# Altium schematic sheet POWER.SchDoc
size A3; SheetNumber: 1; SheetTotal: 2
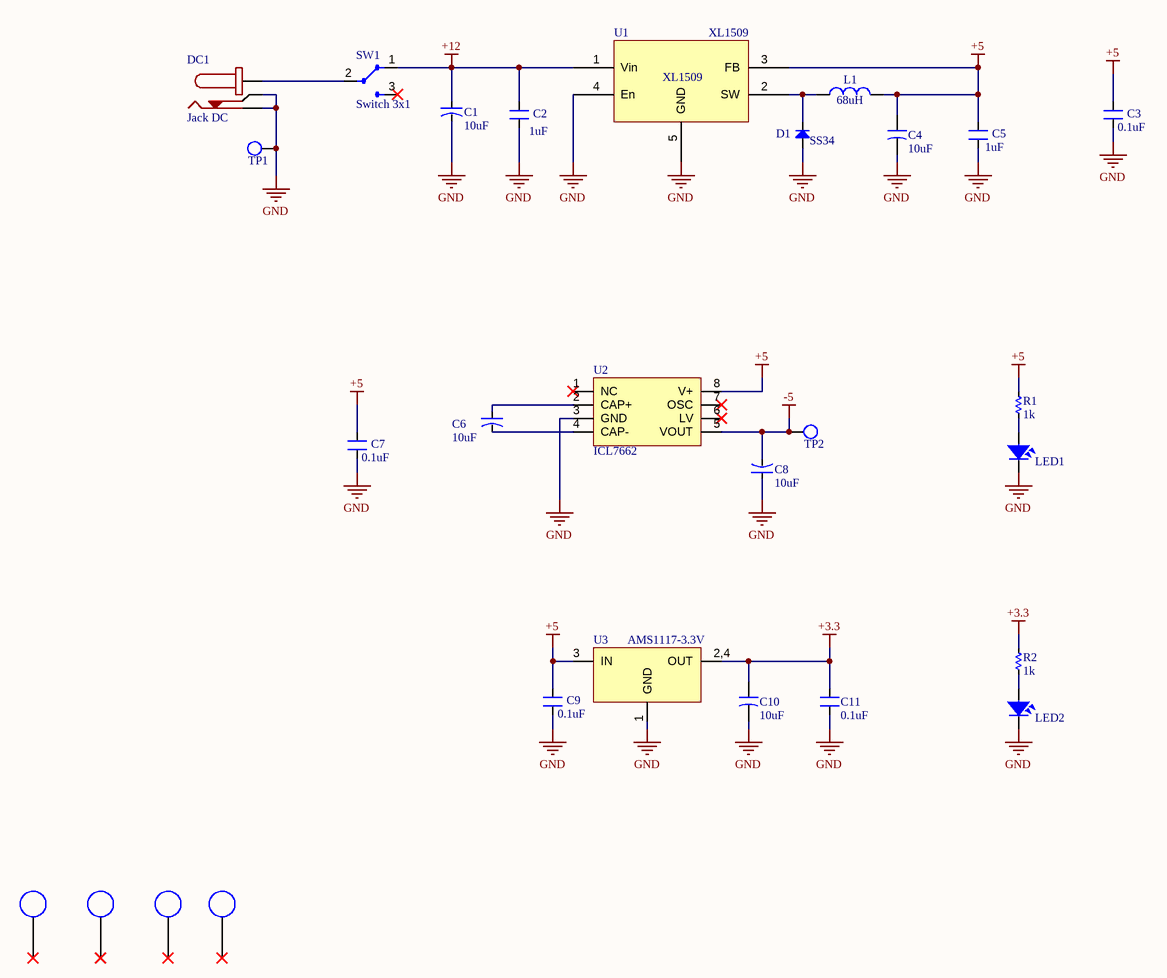
[diagram p0: POWER.SchDoc]

## Parts
C1  10uF  [CAP-ALU-SMD-4.5x5x1.4]
C2  1uF  [CN-SMD-0603]
C3  0.1uF  [CN-SMD-0603]
C4  10uF  [CAP-ALU-SMD-4.5x5x1.4]
C5  1uF  [CN-SMD-0603]
C6  10uF  [CAP-ALU-SMD-4.5x5x1.4]
C7  0.1uF  [CN-SMD-0603]
C8  10uF  [CAP-ALU-SMD-4.5x5x1.4]
C9  0.1uF  [CN-SMD-0603]
C10  10uF  [CAP-ALU-SMD-4.5x5x1.4]
C11  0.1uF  [CN-SMD-0603]
D1  SS34  [DIO-SMD-A]
DC1  Jack DC  [DC0]
H1  M3  [M3]  (value not drawn)
H2  M3  [M3]  (value not drawn)
H3  M3  [M3]  (value not drawn)
H4  M3  [M3]  (value not drawn)
L1  68uH  [L-SMD-M-12x8]
LED1  LED  [LED-0805-Red]  (value not drawn)
LED2  LED  [LED-0805-Red]  (value not drawn)
R1  1k  [RES-SMD-0603]
R2  1k  [RES-SMD-0603]
SW1  Switch 3x1  [SS12D10]
TP1  Test-Point  [TESTPOINT]  (value not drawn)
TP2  Test-Point  [TESTPOINT]  (value not drawn)
U1  XL1509  [SO8]
U2  ICL7662  [SO8]
U3  AMS1117-3.3V  [SOT223]

## Nets
+3.3: C10.1 C11.1 R2.2 U3.2,4(OUT)
+5: C3.1 C4.1 C5.1 C7.1 C9.1 L1.2 R1.2 U1.3(FB) U2.8(V+) U3.3(IN)
+12: C1.1 C2.1 SW1.1 U1.1(Vin)
-5: C8.2 TP2.1 U2.5(VOUT)
GND: C1.2 C2.2 C3.2 C4.2 C5.2 C7.2 C8.1 C9.2 C10.2 C11.2 D1.1(A) DC1.2(TN) DC1.3(T) LED1.2 LED2.2 TP1.1 U1.4(En) U1.5(GND) U2.3(GND) U3.1(GND)
NetC6_1: C6.1 U2.2(CAP+)
NetC6_2: C6.2 U2.4(CAP-)
NetD1_2: D1.2(K) L1.1 U1.2(SW)
NetDC1_1: DC1.1(S) SW1.2
NetLED1_1: LED1.1 R1.1
NetLED2_1: LED2.1 R2.1

Not connected (* = marked no-connect by the designer): H1 1(76)*; H2 1(76)*; H3 1(76)*; H4 1(76)*; SW1 3(I/O2)*; U2 1(NC)* 6(LV)* 7(OSC)*

## Notes on the sheet
- Project:
- Sheet title:
- BAO BUI Q.
- SAMY VE & VY TRAN
- A3
- Sheet
- Checked by:
- of
- Revision:
- Designed by:
- Size:
- Date:

## Library data of the parts
C1 C6 C8 = CN-ALU-DIP: Capacitor (Semiconductor SIM Model); Value: 104; LatestRevisionDate: 17-Jul-2002; LatestRevisionNote: Re-released for DXP Platform.; PackageReference: C1206; Publisher: Altium Limited
C2 C3 C5 C7 C9 C11 = CN: Value: 33pF
C4 C10 = CN-SMD: Polarized Capacitor (Axial); Published: 8-Jun-2000; LatestRevisionDate: 17-Jul-2002; LatestRevisionNote: Re-released for DXP Platform.; PackageReference: POLAR0.8; Publisher: Altium Limited
D1 = Diode SMD: Default Diode; Code - JEDEC: DO-214-AB; Value: 1N5007; Published: 8-Jun-2000; Revision: July-2002: Re-released for DXP Platform.; Publisher: Altium Limited
DC1 = DCIN: Jack DC input; Value: Jac DC
L1 = L-SMD-1: partNo: 78477010; Manufacturer: Wurth Elektronik; Inductance: 1.0 μH; ComponentLink1Description: Manufacturer; ComponentLink1URL: http://www.we-online.de; Created by: Baojun Chen; Created Date: Nov.2015; ComponentLink2Description: Datasheet; ComponentLink2URL: http://katalog.we-online.de/pbs/datasheet/78477010.pdf
LED1 LED2 = LED SMD: Value: LED 3 - 5 ly 2 Colour
R1 R2 = Res-SMD: Resistor; Manufacturer: Generic Components; Class: Passive; Published: 08/06/2000; Publisher: Altium Hobart Technology Centre
SW1 = SW3x1: Value: Switch 4x2
U1 = XL1509: pin to pad: 5>5+6+7+8
U2 = ICL7660: CMOS Voltage Converters; Creator: Nguyen Ba Bien
U3 = LM1117: 800mA Low-Dropout Linear Regulator; Creator: Nguyen Ba Bien; Website: http://group3i.net